# EAGLE schematic RA-C001-A (EAGLE 6.4)
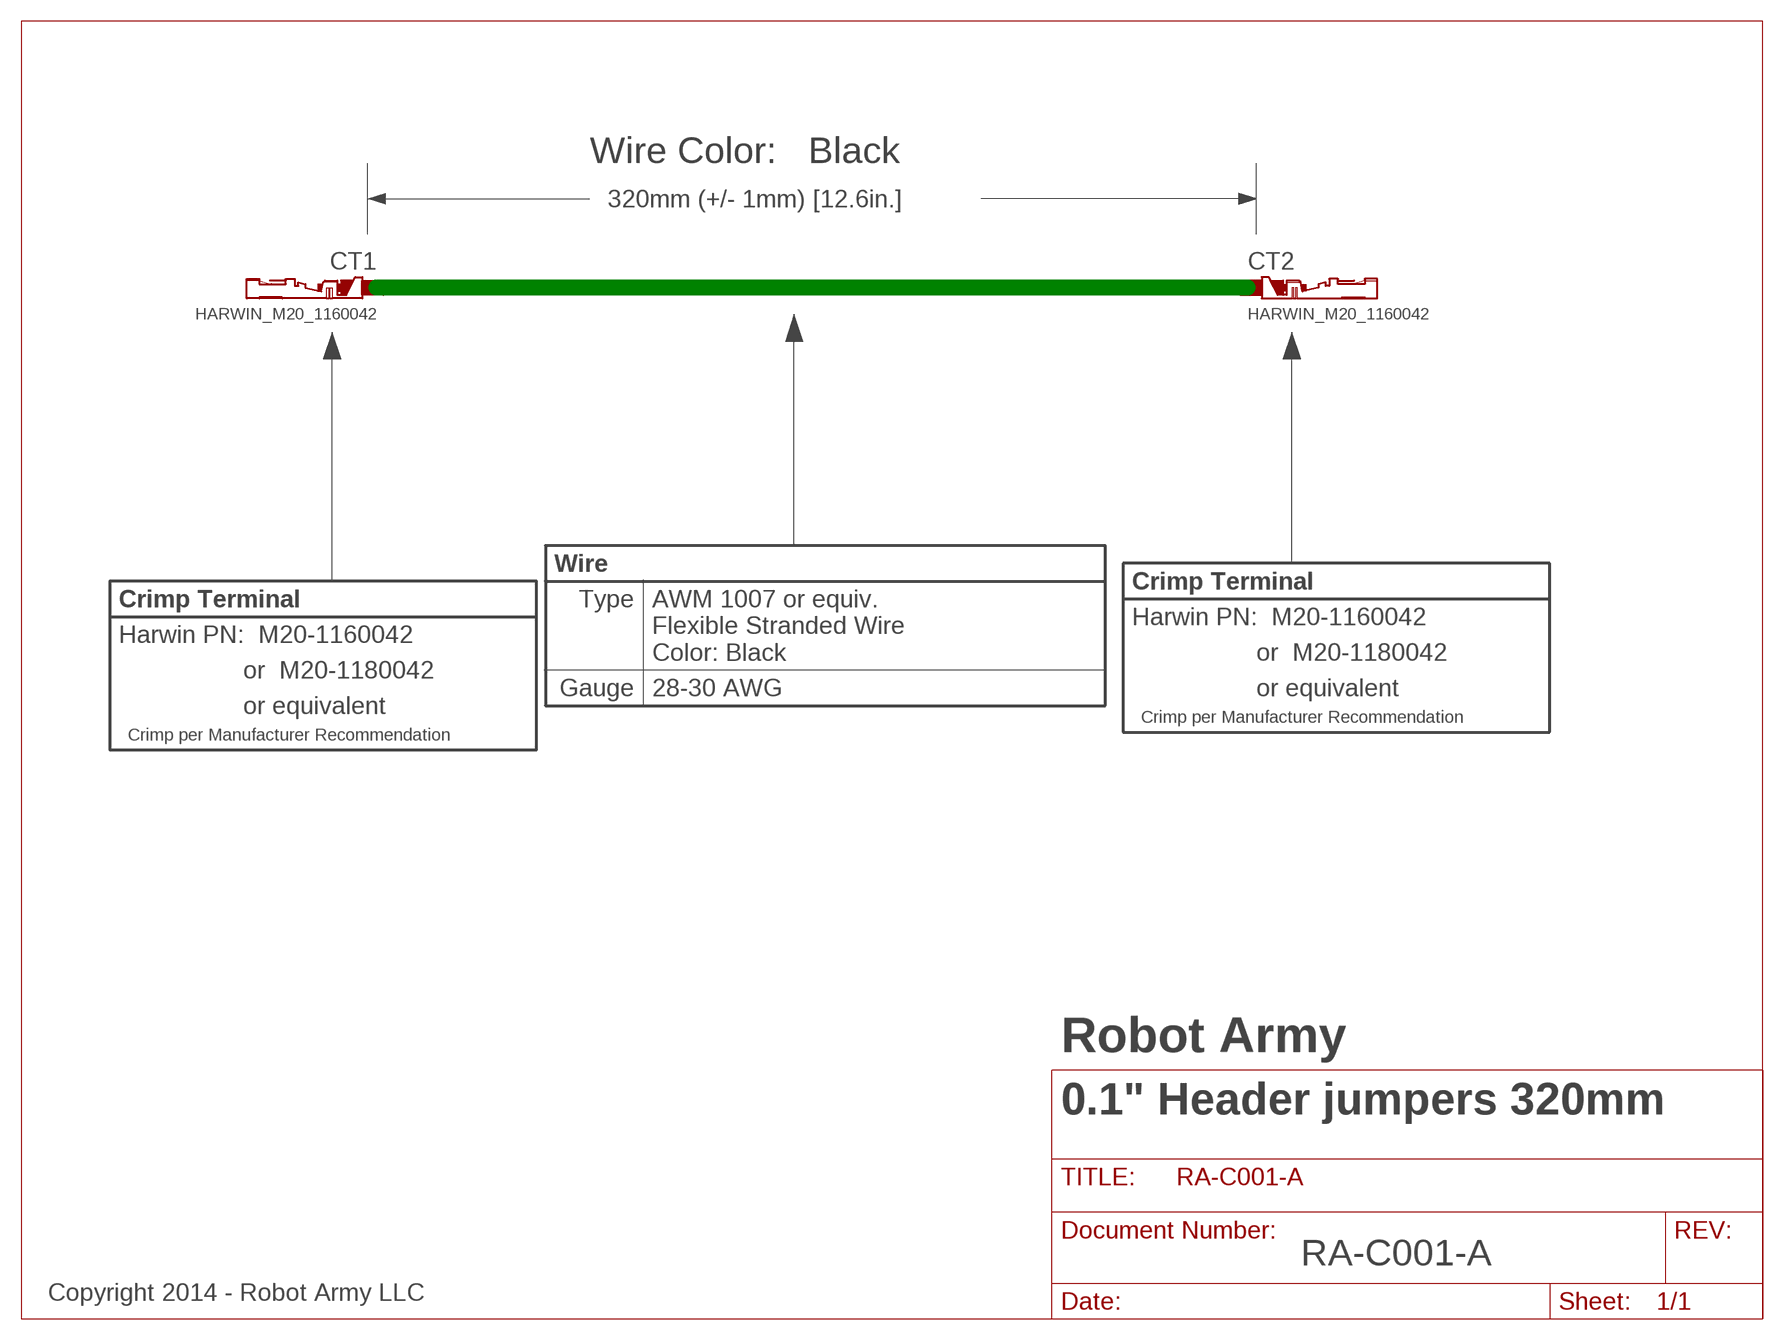
[diagram p0: schematic, sheet 1]
FRAME1 (LETTER_L): DOCUMENT_NUMBER: RA-C001-A

## Parts
CT1  HARWIN_M20_1160042  HARWIN_M20_2.54MM_CONTACT  [TERMINAL_GENERIC]
CT2  HARWIN_M20_1160042  HARWIN_M20_2.54MM_CONTACT  [TERMINAL_GENERIC]

## Nets
N$1: CT1.1 CT2.1

## Notes on the sheet
- Wire Color:   Black
- 320mm (+/- 1mm) [12.6in.]
- Wire
- AWM 1007 or equiv.
  Flexible Stranded Wire
  Color: Black
- Crimp Terminal
- Crimp Terminal | Type
- Harwin PN:  M20-1160042
- Harwin PN:  M20-1160042
- or  M20-1180042
- or  M20-1180042
- Gauge | 28-30 AWG | or equivalent
- or equivalent
- Crimp per Manufacturer Recommendation
- Crimp per Manufacturer Recommendation
- Robot Army
- 0.1" Header jumpers 320mm
- Copyright 2014 - Robot Army LLC

## Library data of the parts
CT1 CT2 = robicon-cables:HARWIN_M20_2.54MM_CONTACT: Harwin 0.1" Female Crimp Terninal